# EAGLE design KranPowerV2_1 (EAGLE 6.1)
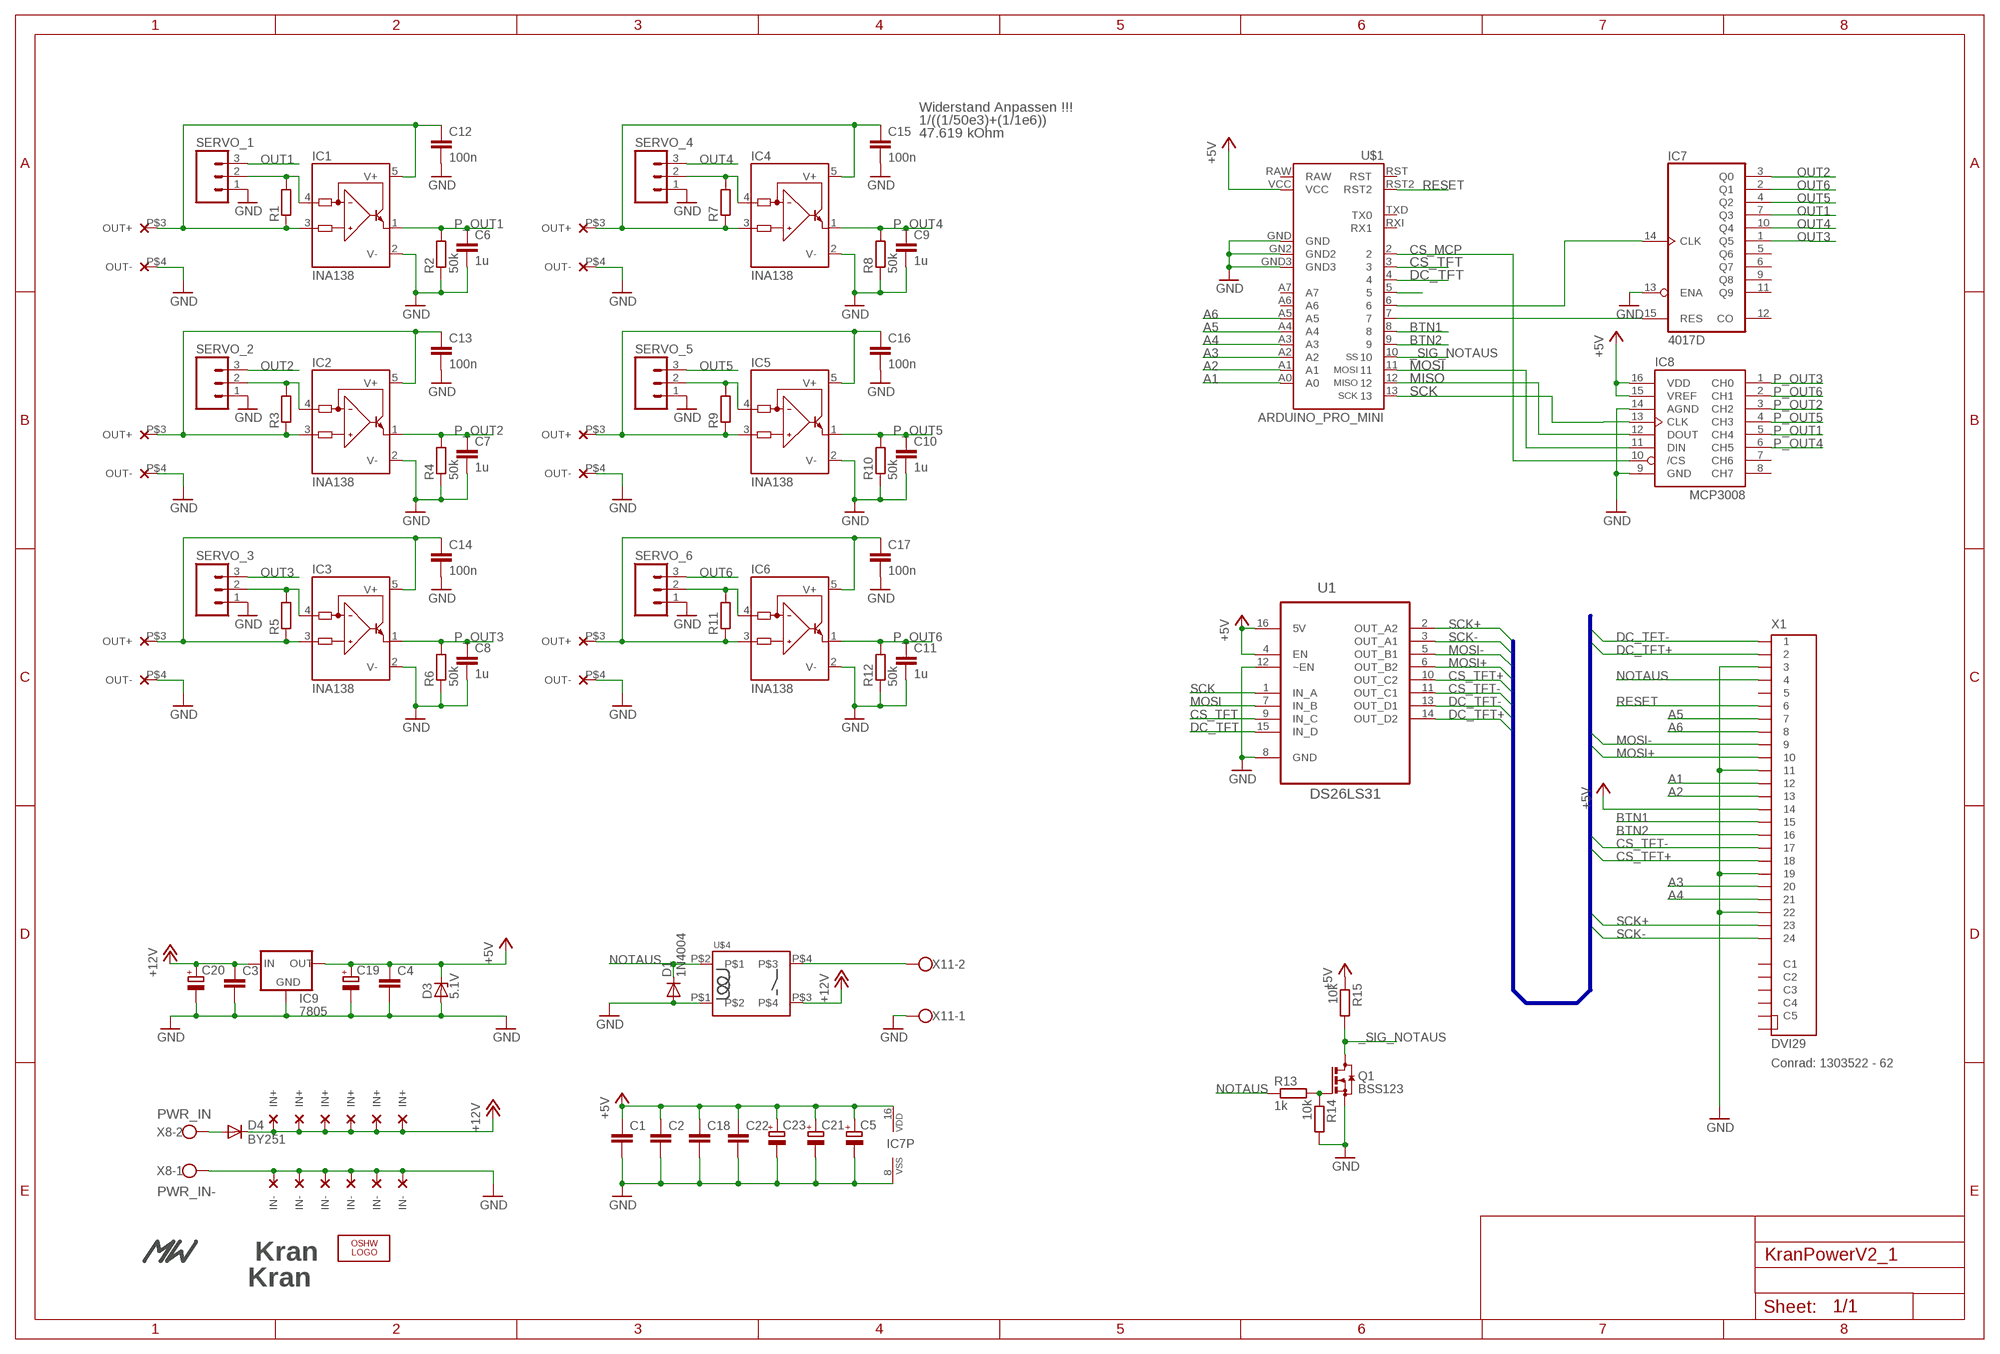
[diagram p0: schematic, sheet 1]

## Parts
C1  C-EUC0603  [C0603]
C2  C-EUC0603  [C0603]
C3  C-EUC0603  [C0603]
C4  C-EUC0603  [C0603]
C5  CPOL-EUSMCB  [SMC_B]
C6  1u  C-EUC0603  [C0603]
C7  1u  C-EUC0603  [C0603]
C8  1u  C-EUC0603  [C0603]
C9  1u  C-EUC0603  [C0603]
C10  1u  C-EUC0603  [C0603]
C11  1u  C-EUC0603  [C0603]
C12  100n  C-EUC0603  [C0603]
C13  100n  C-EUC0603  [C0603]
C14  100n  C-EUC0603  [C0603]
C15  100n  C-EUC0603  [C0603]
C16  100n  C-EUC0603  [C0603]
C17  100n  C-EUC0603  [C0603]
C18  C-EUC0603  [C0603]
C19  CPOL-EUSMCB  [SMC_B]
C20  CPOL-EUSMCB  [SMC_B]
C21  CPOL-EUSMCB  [SMC_B]
C22  C-EUC0603  [C0603]
C23  CPOL-EUSMCB  [SMC_B]
D1  1N4004  [DO41-10]
D3  5.1V  ZENER-DIODEDO34-7  [DO34Z7]
D4  BY251  [DO201-15]
IC1  INA138  [SOT23-5]
IC2  INA138  [SOT23-5]
IC3  INA138  [SOT23-5]
IC4  INA138  [SOT23-5]
IC5  INA138  [SOT23-5]
IC6  INA138  [SOT23-5]
IC7  4017D  [SO16]
IC8  MCP3008  [SO16]
IC9  7805  V_REG_78XXSIDE  [78XXL]
LOGO1  OSHW_LOGO_FILLX0350-NT  [OSHW_FILLX350_NOTEXT]
Q1  BSS123  [SOT23]
R1  R-EU_R2512  [R2512]
R2  50k  R-EU_R0603  [R0603]
R3  R-EU_R2512  [R2512]
R4  50k  R-EU_R0603  [R0603]
R5  R-EU_R2512  [R2512]
R6  50k  R-EU_R0603  [R0603]
R7  R-EU_R2512  [R2512]
R8  50k  R-EU_R0603  [R0603]
R9  R-EU_R2512  [R2512]
R10  50k  R-EU_R0603  [R0603]
R11  R-EU_R2512  [R2512]
R12  50k  R-EU_R0603  [R0603]
R13  1k  R-EU_R0603  [R0603]
R14  10k  R-EU_R0603  [R0603]
R15  10k  R-EU_R0603  [R0603]
SERVO_1  M03LOCK  [1X03_LOCK]
SERVO_2  M03LOCK  [1X03_LOCK]
SERVO_3  M03LOCK  [1X03_LOCK]
SERVO_4  M03LOCK  [1X03_LOCK]
SERVO_5  M03LOCK  [1X03_LOCK]
SERVO_6  M03LOCK  [1X03_LOCK]
U1  DS26LS31  DS26LS31CM  [SOIC127P600X175-16N]
U$1  ARDUINO_PRO_MINI  [ARDUINO_PRO_MINI]
U$2  MW_LOGO  [MW_11X5MM]
U$3  KRAN_LOGO  [KRAN_LOGO]
U$4  RELAY_ZETTLER_AZ767  [RELAY_ZETTLER_AZ767]
U$5  LM2596_STEPDOWN  [LM2596_STEPDOWN]
U$6  LM2596_STEPDOWN  [LM2596_STEPDOWN]
U$7  LM2596_STEPDOWN  [LM2596_STEPDOWN]
U$8  LM2596_STEPDOWN  [LM2596_STEPDOWN]
U$9  LM2596_STEPDOWN  [LM2596_STEPDOWN]
U$10  LM2596_STEPDOWN  [LM2596_STEPDOWN]
U$13  KRAN_LOGO  [KRAN_LOGO]
X1  DVI29  [CCDVI-29DVISIR-A-2]
X8  W237-102  [W237-102]
X11  W237-102  [W237-102]

## Nets
+5V: C1.1 C2.1 C4.1 C5.+ C18.1 C19.+ C21.+ C22.1 C23.+ D3.C IC7.16(VDD) IC8.15(VREF) IC8.16(VDD) IC9.OUT R15.1 U1.4(EN) U1.16(5V) U$1.VCC X1.14
+12V: C3.1 C20.+ D4.C IC9.IN U$4.P$3 U$5.P$1(IN+) U$6.P$1(IN+) U$7.P$1(IN+) U$8.P$1(IN+) U$9.P$1(IN+) U$10.P$1(IN+)
_SIG_NOTAUS: Q1.3(D) R15.2 U$1.10
A1: U$1.A0 X1.12
A2: U$1.A1 X1.13
A3: U$1.A2 X1.20
A4: U$1.A3 X1.21
A5: U$1.A4 X1.7
A6: U$1.A5 X1.8
BTN1: U$1.8 X1.15
BTN2: U$1.9 X1.16
CS_MCP: IC8.10(/CS) U$1.2
CS_TFT: U1.9(IN_C) U$1.3
CS_TFT+: U1.10(OUT_C2) X1.18
CS_TFT-: U1.11(OUT_C1) X1.17
DC_TFT: U1.15(IN_D) U$1.4
DC_TFT+: U1.14(OUT_D2) X1.2
DC_TFT-: U1.13(OUT_D1) X1.1
GND: C1.2 C2.2 C3.2 C4.2 C5.- C6.2 C7.2 C8.2 C9.2 C10.2 C11.2 C12.2 C13.2 C14.2 C15.2 C16.2 C17.2 C18.2 C19.- C20.- C21.- C22.2 C23.- D1.A D3.A IC1.2(V-) IC2.2(V-) IC3.2(V-) IC4.2(V-) IC5.2(V-) IC6.2(V-) IC7.8(VSS) IC7.13(ENA) IC8.9(GND) IC8.14(AGND) IC9.GND Q1.2(S) R2.1 R4.1 R6.1 R8.1 R10.1 R12.1 R14.2 SERVO_1.1 SERVO_2.1 SERVO_3.1 SERVO_4.1 SERVO_5.1 SERVO_6.1 U1.8(GND) U1.12(~EN) U$1.GN2(GND2) U$1.GND U$1.GND3 U$4.P$1 U$5.P$2(IN-) U$5.P$4(OUT-) U$6.P$2(IN-) U$6.P$4(OUT-) U$7.P$2(IN-) U$7.P$4(OUT-) U$8.P$2(IN-) U$8.P$4(OUT-) U$9.P$2(IN-) U$9.P$4(OUT-) U$10.P$2(IN-) U$10.P$4(OUT-) X1.3 X1.11 X1.19 X1.22 X8.1 X11.1
MISO: IC8.12(DOUT) U$1.12
MOSI: IC8.11(DIN) U1.7(IN_B) U$1.11
MOSI+: U1.6(OUT_B2) X1.10
MOSI-: U1.5(OUT_B1) X1.9
N$1: C12.1 IC1.3(IN+) IC1.5(V+) R1.1 U$5.P$3(OUT+)
N$2: IC1.4(IN-) R1.2 SERVO_1.2
N$3: C13.1 IC2.3(IN+) IC2.5(V+) R3.1 U$6.P$3(OUT+)
N$4: IC2.4(IN-) R3.2 SERVO_2.2
N$5: C14.1 IC3.3(IN+) IC3.5(V+) R5.1 U$7.P$3(OUT+)
N$6: IC3.4(IN-) R5.2 SERVO_3.2
N$7: C15.1 IC4.3(IN+) IC4.5(V+) R7.1 U$8.P$3(OUT+)
N$8: IC4.4(IN-) R7.2 SERVO_4.2
N$9: C16.1 IC5.3(IN+) IC5.5(V+) R9.1 U$9.P$3(OUT+)
N$10: IC5.4(IN-) R9.2 SERVO_5.2
N$11: C17.1 IC6.3(IN+) IC6.5(V+) R11.1 U$10.P$3(OUT+)
N$12: IC6.4(IN-) R11.2 SERVO_6.2
N$13: D4.A X8.2
N$14: IC7.14(CLK) U$1.6
N$15: IC7.15(RES) U$1.7
N$16: Q1.1(G) R13.2 R14.1
N$17: U$4.P$4 X11.2
N$18: U$1.5
NOTAUS: D1.C R13.1 U$4.P$2 X1.4
OUT1: IC7.7(Q3) SERVO_1.3
OUT2: IC7.3(Q0) SERVO_2.3
OUT3: IC7.1(Q5) SERVO_3.3
OUT4: IC7.10(Q4) SERVO_4.3
OUT5: IC7.4(Q2) SERVO_5.3
OUT6: IC7.2(Q1) SERVO_6.3
P_OUT1: C6.1 IC1.1(OUT) IC8.5(CH4) R2.2
P_OUT2: C7.1 IC2.1(OUT) IC8.3(CH2) R4.2
P_OUT3: C8.1 IC3.1(OUT) IC8.1(CH0) R6.2
P_OUT4: C9.1 IC4.1(OUT) IC8.6(CH5) R8.2
P_OUT5: C10.1 IC5.1(OUT) IC8.4(CH3) R10.2
P_OUT6: C11.1 IC6.1(OUT) IC8.2(CH1) R12.2
RESET: U$1.RST2 X1.6
SCK: IC8.13(CLK) U1.1(IN_A) U$1.13
SCK+: U1.2(OUT_A2) X1.23
SCK-: U1.3(OUT_A1) X1.24
Unconnected: IC7.5(Q6) IC7.6(Q7) IC7.9(Q8) IC7.11(Q9) IC7.12(CO) IC8.7(CH6) IC8.8(CH7) U$1.A6 U$1.A7 U$1.RAW U$1.RST U$1.RXI(RX1) U$1.TXD(TX0) X1.5 X1.C1 X1.C2 X1.C3 X1.C4 X1.C5.1(C5) X1.C5.2

## Buses
MISO+,MISO-,DC_TFT+,DC_TFT-,MOSI+,MOSI-,CS_TFT+,CS_TFT-,SCK+,SCK-

## Notes on the sheet
- Widerstand Anpassen !!!
- 1/((1/50e3)+(1/1e6))
- 47.619 kOhm
- Conrad: 1303522 - 62
- PWR_IN
- PWR_IN-
- /Users/MatthiasMac/Downloads/kran.bmp

## Library data of the parts
C1-C4 C6-C18 C22 = rcl:C-EU: CAPACITOR, European symbol
C5 C19-C21 C23 = rcl:CPOL-EU: POLARIZED CAPACITOR, European symbol
D1 = diode:1N4004: DIODE general purpose rectifier, 1 A
D3 = diode:ZENER-DIODE: Z-Diode
D4 = diode:BY251: DIODE Si, 200 V, 3 A
IC1-IC6 = burr-brown:INA138: High-Side Measurement Current Shunt Monitor; MF: TEXAS INSTRUMENTS; MPN: INA138NA/250; OC_FARNELL: 1564888; OC_NEWARK: 80K5906
IC7 = 40xx:4017: COUNTER/DIVIDER
IC8 = adafruit:MCP3008
IC9 = SparkFun:V_REG_78XX: Voltage Regulator Standard 7805 5V regulator. IGO (Input Ground Output). Spark Fun Electronics SKU : COM-00107
LOGO1 = ohw-logo:OSHW_LOGO_FILL
Q1 = transistor-small-signal:BSS123: N-CHANNEL MOS FET
R1-R15 = rcl:R-EU_: RESISTOR, European symbol
SERVO_1-SERVO_6 = SparkFun:M03: Header 3 Standard 3-pin 0.1" header. Use with straight break away headers (SKU : PRT-00116), right angle break away headers (PRT-00553), swiss pins (PRT-00743), machine pins (PRT-00117), and female headers (PRT-00115). Molex polarized connector foot print use with SKU : PRT-08232 with associated crimp pins and housings.
U1 = Matthias:DS26LS31CM: Line Driver; MPN: DS26LS31CM; OC_FARNELL: 9487859; OC_NEWARK: 07B5236; PACKAGE: SOIC-16; SUPPLIER: NationalSemiconductor
U$1 = SparkFun:ARDUINO_PRO_MINI
U$2 = MWlogo:MW_LOGO
U$3 U$13 = MWlogo:KRAN_LOGO
U$4 = SparkFun:RELAY_ZETTLER_AZ767: http://www.conrad.de/ce/de/product/503633/Subminiatur-Leistungs-Relais-AZ767-10-A-Zettler-Electronics-AZ767-1A-6DE-6-VDC-1-Schliesser-Max-DC-5-AAC-10-A-Max?queryFromSuggest=true
U$5-U$10 = LM2596_stepdown:LM2596_STEPDOWN
X1 = con-cypressindustries:DVI29: DVI 29 Connctor Source: http://www.cypressindustries.com/pdf/CCDVI-29DVISIR-A-2.pdf; OC_FARNELL: unknown; OC_NEWARK: unknown
X8 X11 = con-wago-500:W237-102: WAGO SCREW CLAMP; MPN: 237-102; OC_FARNELL: unknown; OC_NEWARK: 70K9898

## Board
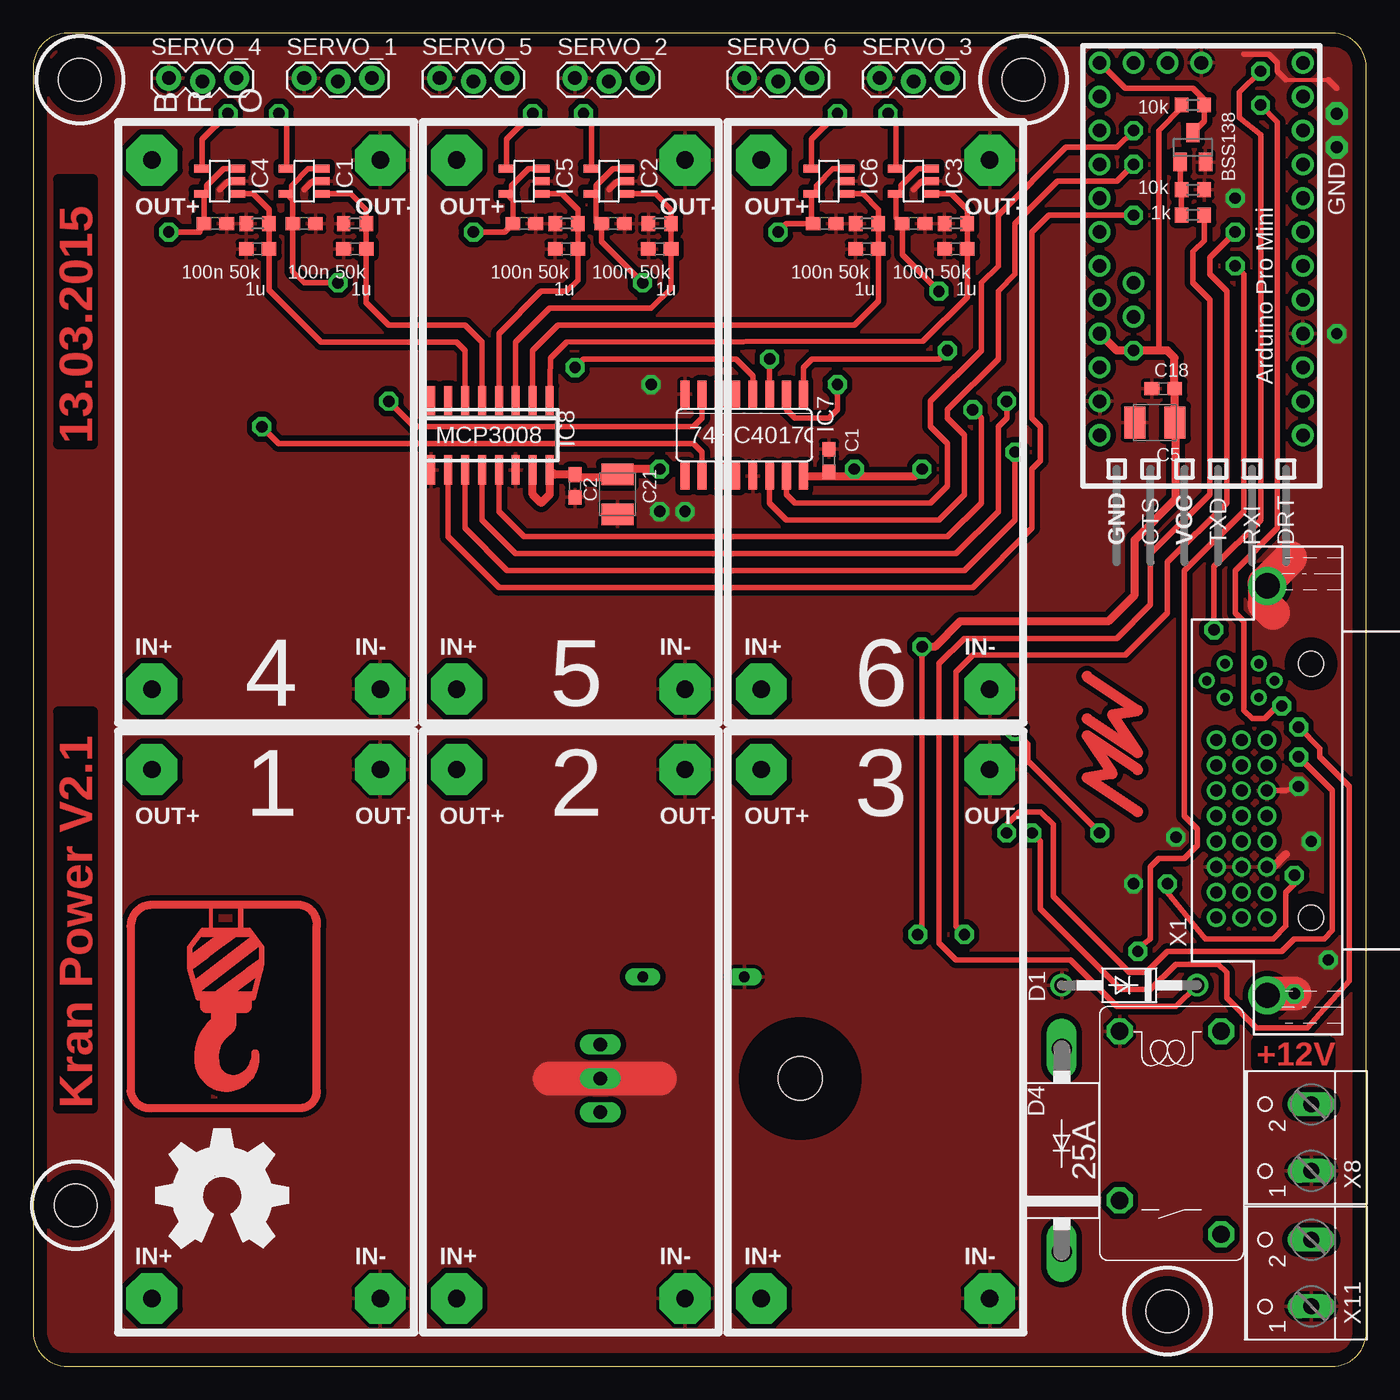
[diagram p1: board, top side]
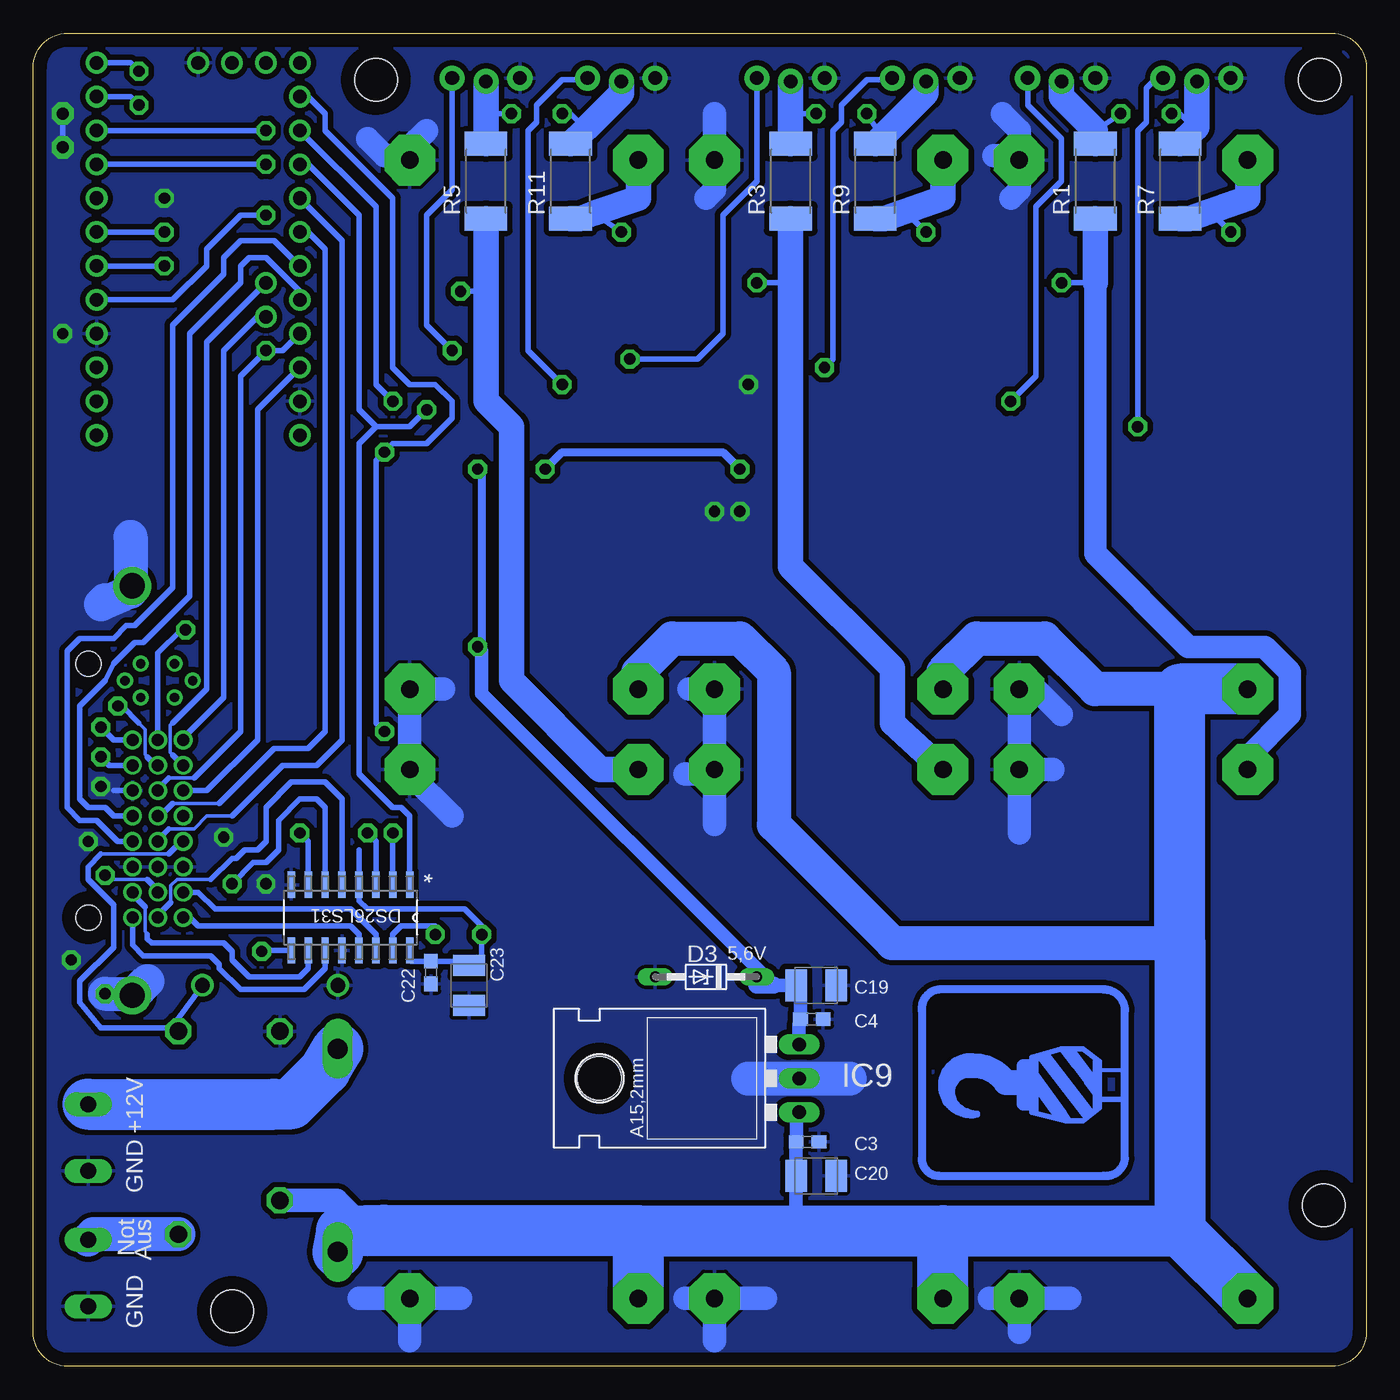
[diagram p2: board, bottom side, seen from below]

Size 100 x 100 mm. Coordinates in mm from the lower left corner, seen from the top.
Outline: 0,97.46 0,2.54 arc90 2.54,0 97.46,0 arc90 100,2.54 100,97.46 arc90 97.46,100 2.54,100 arc90 0,97.46
Copper layers (1*16): Top 0.035mm / dielectric 1.5mm / Bottom 0.035mm
Design rules: minimum track width 10mil, minimum drill 24mil, track to track 8mil, track to pad 8mil, pad to pad 8mil, via to via 8mil, smd to smd 8mil, copper to edge 40mil, drill to drill 8mil, minimum pad ring 10mil, minimum via ring 8mil, stop-mask expansion 4mil, vias tented up to drill 35mil, thermal gap 10mil
Holes 3.2 mm at 3.17,12.06 3.49,96.52 74.3,96.52 85.09,4.13

### Footprints (pad centres in the part's own frame; a part is rotated, then mirrored left to right if it is on the bottom)
C0603 = smd 1.1 x 1: 1 -0.85,0; 2 0.85,0
SMC_B = smd 1.6 x 2.4: + -1.5,0; - 1.5,0
DO41-10 = drill 1.118: A 5.08,0; C -5.08,0
DO34Z7 = drill 0.813 long: A 3.81,0; C -3.81,0
DO201-15 = drill 1.499 long: A 7.62,0; C -7.62,0
SOT23-5 = smd 0.6 x 1.2: 1 -0.95,-1.306; 2 0,-1.306; 3 0.95,-1.306; 4 0.95,1.306; 5 -0.95,1.306
SO16 = smd 0.66 x 2.032: 1 -4.445,-3.073; 2 -3.175,-3.073; 3 -1.905,-3.073; 4 -0.635,-3.073; 5 0.635,-3.073; 6 1.905,-3.073; 7 3.175,-3.073; 8 4.445,-3.073; 9 4.445,3.073; 10 3.175,3.073; 11 1.905,3.073; 12 0.635,3.073; 13 -0.635,3.073; 14 -1.905,3.073; 15 -3.175,3.073; 16 -4.445,3.073
SO16' = smd 0.6 x 2.2: 1 -4.445,-2.6; 2 -3.175,-2.6; 3 -1.905,-2.6; 4 -0.635,-2.6; 5 0.635,-2.6; 6 1.905,-2.6; 7 3.175,-2.6; 8 4.445,-2.6; 9 4.445,2.6; 10 3.175,2.6; 11 1.905,2.6; 12 0.635,2.6; 13 -0.635,2.6; 14 -1.905,2.6; 15 -3.175,2.6; 16 -4.445,2.6
78XXL = drill 1.016 long: GND 0,-3.81; IN -2.54,-3.81; OUT 2.54,-3.81 | hole 3.302: 0,11.176
SOT23 = smd 1 x 1.4: 1 -0.95,-1.1; 2 0.95,-1.1; 3 0,1.1
R2512 = smd 1.8 x 3.2: 1 -2.8,0; 2 2.8,0
R0603 = smd 1 x 1.1: 1 -0.85,0; 2 0.85,0
1X03_LOCK = drill 1.016 pad 1.88: 1 0,0.127; 2 2.54,-0.127; 3 5.08,0.127
SOIC127P600X175-16N = smd 1.981 x 0.559: 1 -2.464,4.445; 2 -2.464,3.175; 3 -2.464,1.905; 4 -2.464,0.635; 5 -2.464,-0.635; 6 -2.464,-1.905; 7 -2.464,-3.175; 8 -2.464,-4.445; 9 2.464,-4.445; 10 2.464,-3.175; 11 2.464,-1.905; 12 2.464,-0.635; 13 2.464,0.635; 14 2.464,1.905; 15 2.464,3.175; 16 2.464,4.445
ARDUINO_PRO_MINI = drill 1.016 pad 1.626: 2 1.27,19.05; 3 1.27,16.51; 4 1.27,13.97; 5 1.27,11.43; 6 1.27,8.89; 7 1.27,6.35; 8 1.27,3.81; 9 1.27,1.27; 10 16.51,1.27; 11 16.51,3.81; 12 16.51,6.35; 13 16.51,8.89; A0 16.51,11.43; A1 16.51,13.97; A2 16.51,16.51; A3 16.51,19.05; A4 13.97,17.78; A5 13.97,20.32; A6 11.43,1.27; A7 13.97,1.27; GN2 16.51,26.67; GND 1.27,21.59; GND3 8.89,1.27; RAW 16.51,29.21; RST 1.27,24.13; RST2 16.51,24.13; RXI 1.27,26.67; TXD 1.27,29.21; VCC 16.51,21.59
RELAY_ZETTLER_AZ767 = drill 1.3 octagon: P$1 1.85,1.49; P$2 1.85,9.11; P$3 14.55,1.49; P$4 17.09,9.11
LM2596_STEPDOWN = drill 1.3 pad 3.81 octagon: P$1 0,0; P$2 17.145,0; P$3 0,39.69; P$4 17.145,39.69
CCDVI-29DVISIR-A-2 = drill 0.9 pad 1.27: 1 -9.525,9.04; 2 -7.62,9.04; 3 -5.715,9.04; 4 -3.81,9.04; 5 -1.905,9.04; 6 0,9.04; 7 1.905,9.04; 8 3.81,9.04; 9 -9.525,7.135; 10 -7.62,7.135; 11 -5.715,7.135; 12 -3.81,7.135; 13 -1.905,7.135; 14 0,7.135; 15 1.905,7.135; 16 3.81,7.135; 17 -9.525,5.23; 18 -7.62,5.23; 19 -5.715,5.23; 20 -3.81,5.23; 21 -1.905,5.23; 22 0,5.23; 23 1.905,5.23; 24 3.81,5.23 | drill 0.7 pad 1.016: C1 6.985,8.382; C2 9.525,8.382; C3 6.985,5.842; C4 9.525,5.842; C5.1 8.255,9.745; C5.2 8.255,4.665 | drill 1.9 pad 2.54: M1 -15.365,5.205; M2 15.365,5.205 | hole 1.9: -9.525,1.93; 9.525,1.93
W237-102 = drill 1.194 long: 1 -2.5,-1.27; 2 2.5,-1.27

### Placement (x,y rotation side)
C1  59.69,67.94 90 top
C2  40.64,66.04 270 top
C3  41.91,16.83 0 bottom
C4  41.59,26.04 0 bottom
C5  84.14,70.8 180 top
C6  24.13,83.82 180 top
C7  46.99,83.82 180 top
C8  69.22,83.82 180 top
C9  16.83,83.82 180 top
C10  40.01,83.82 180 top
C11  62.55,83.82 180 top
C12  20.32,85.72 0 top
C13  43.5,85.72 0 top
C14  66.04,85.72 0 top
C15  13.65,85.72 0 top
C16  36.83,85.72 0 top
C17  59.37,85.72 0 top
C18  84.77,73.34 180 top
C19  41.27,28.57 0 bottom
C20  41.27,14.29 0 bottom
C21  43.81,65.41 270 top
C22  70.17,29.53 270 bottom
C23  67.31,28.57 270 bottom
D1  82.23,28.57 180 top
D3  49.53,29.21 180 bottom
D4  77.15,16.19 90 top
IC1  20.32,88.9 90 top
IC2  43.18,88.9 90 top
IC3  66.04,88.9 90 top
IC4  13.97,88.9 90 top
IC5  36.83,88.9 90 top
IC6  59.69,88.9 90 top
IC7  53.34,69.85 180 top
IC8  MCP3008  [SO16']  34.29,69.85 180 top
IC9  46.35,21.59 90 bottom
LOGO1  9.21,8.89 0 top
Q1  87,91.44 0 top
R1  20.32,88.9 90 bottom
R2  24.13,85.72 0 top
R3  43.18,88.9 90 bottom
R4  46.99,85.72 0 top
R5  66.04,88.9 90 bottom
R6  69.22,85.72 0 top
R7  13.97,88.9 90 bottom
R8  16.83,85.72 0 top
R9  36.83,88.9 90 bottom
R10  40.01,85.72 0 top
R11  59.69,88.9 90 bottom
R12  62.55,85.72 0 top
R13  87,86.36 180 top
R14  87,88.27 0 top
R15  87,94.61 0 top
SERVO_1  20.32,96.52 0 top
SERVO_2  40.64,96.52 0 top
SERVO_3  63.5,96.52 0 top
SERVO_4  10.16,96.52 0 top
SERVO_5  30.48,96.52 0 top
SERVO_6  53.34,96.52 0 top
U1  76.2,33.66 270 bottom
U$1  96.52,99.06 180 top
U$2  82.87,41.59 90 top
U$3  33.66,28.57 270 bottom
U$4  80.01,26.99 270 top
U$5  8.89,5.08 0 top
U$6  31.75,5.08 0 top
U$7  54.61,5.08 0 top
U$8  8.89,50.8 0 top
U$9  31.75,50.8 0 top
U$10  54.61,50.8 0 top
U$11  [MW_11X5MM_SOLDER]  82.87,41.59 90 top
U$12  [KRAN_LOGO_STOP]  33.66,28.57 270 bottom
U$13  6.99,19.05 0 top
U$14  [KRAN_LOGO_STOP]  6.99,19.05 0 top
X1  97.79,43.18 90 top
X8  94.61,17.14 90 top
X11  94.61,6.99 90 top

### Tracks (layer width: path | path; a pad name or v marks a point on that pad's centre or on a via)
+5V  (via drill 0.85 pad 1.42)
  Top 0.406: C1.1 59.69,66.78 | R15.1 86.14,94.4 84.45,92.71 84.45,76.2 | v66.36,32.38 66.36,32.7 66.67,33.02 v66.67,53.98
  Top 0.61: 61.59,66.78 59.69,66.78 IC7.16 58.52,66.78 | 61.59,66.78 66.14,66.78 v66.67,67.31 | v46.99,67.31 44.45,67.31 43.81,66.67 | v61.59,67.31 61.59,66.78 | 43.81,66.67 C21.+ | 43.81,66.67 40.85,66.67 C2.1 39.09,66.89 IC8.16 38.73,65.41 38.1,64.77 37.47,65.41 IC8.15 | U$1.VCC 81.28,76.2 v82.55,76.2 84.45,76.2 85.09,76.2 85.62,75.67 C18.1 85.64,73.33 C5.+ 85.72,70.72 85.72,65.09 82.64,62 82.64,57.87 80.64,55.88 69.53,55.88 67.63,53.98 v66.67,53.98
  Bottom 0.254: 89.85,44.13 87.95,44.13
  Bottom 0.406: X1.14 90.66,43.33 89.85,44.13 | 87.95,44.13 84.45,47.62 84.45,74.3 v82.55,76.2 81.28,76.2 U$1.VCC | 75.56,38.73 U1.4 75.56,34.92 74.93,34.29 67.63,34.29 66.36,33.02 v66.36,32.38 66.36,30.8 67.08,30.07 C23.+ 67.61,30.38 C22.1 71.65,30.38 71.75,30.48 U1.16 | 45.72,28.57 D3.C
  Bottom 0.61: v66.67,67.31 66.36,66.99 66.36,54.29 v66.67,53.98 | v61.59,67.31 60.33,68.58 48.26,68.58 v46.99,67.31
  Bottom 1.016: v66.67,53.98 66.36,53.66 66.36,50.48 44.45,28.57 C19.+ 42.46,28.27 C4.1 42.55,25.61 IC9.OUT
  Bottom 1.27: 44.45,28.57 45.72,28.57
+12V
  Bottom 1.016: 67.31,11.43 67.31,10.16 | 42.86,10.16 42.77,10.25 C20.+ 42.77,16.5 C3.1 42.76,18.84 IC9.IN
  Bottom 1.778: U$4.P$3 77.25,12.44 74.97,10.16
  Bottom 2.54: U$9.P$1 31.75,52.07 29.21,54.61 24.13,54.61 20.32,50.8 13.97,50.8 | U$10.P$1 54.61,52.07 52.07,54.61 46.99,54.61 44.45,52.07 44.45,40.64 35.56,31.75 13.97,31.75
  Bottom 3.81: U$6.P$1 31.75,10.16 | 31.75,10.16 13.97,10.16 | 13.97,10.16 U$5.P$1 | U$7.P$1 54.61,10.16 | 54.61,10.16 42.86,10.16 31.75,10.16 | 54.61,10.16 67.31,10.16 74.97,10.16 | 13.97,10.16 13.97,31.75 13.97,50.8 U$8.P$1 | 74.97,10.16 73.7,10.2 | 74.97,10.16 76.88,10.12 D4.C
_SIG_NOTAUS
  Top 0.406: U$1.10 81.92,95.89 87,95.89 87.84,95.03 R15.2 87.84,93.39 Q1.3
A1
  Bottom 0.254: 89.85,40.32 87.95,40.32 87,41.27 85.09,41.27
  Bottom 0.406: X1.12 90.66,39.52 89.85,40.32 | 85.09,41.27 81.28,45.09 78.74,45.09 76.83,46.99 76.83,84.45 U$1.A0
A2
  Bottom 0.254: 89.53,42.23 86.04,42.23
  Bottom 0.406: X1.13 90.49,41.27 89.53,42.23 | 86.04,42.23 81.92,46.35 79.38,46.35 78.11,47.62 78.11,83.82 79.38,85.09 U$1.A1
A3
  Bottom 0.406: X1.20 93.66,39.37 95.25,40.96 96.52,40.96 97.47,41.91 97.47,53.66 96.52,54.61 93.98,54.61 93.03,55.56 92.39,55.56 89.53,58.42 89.53,78.11 85.72,81.92 85.72,83.19 84.45,84.45 81.92,84.45 U$1.A2
A4
  Bottom 0.406: X1.21 93.98,41.27 94.61,41.91 95.89,41.91 96.52,42.55 96.52,49.53 94.61,51.44 93.98,52.7 92.39,54.29 91.76,54.29 88.27,57.78 88.27,77.47 84.45,81.28 84.45,82.55 83.82,83.19 82.55,83.19 80.01,80.64 U$1.A3
A5
  Bottom 0.254: 89.53,45.87 89.53,45.89 89.71,46.05 89.71,48.1 89.53,48.26
  Bottom 0.406: U$1.A4 87,76.83 87,50.8 89.53,48.26 | 89.53,45.87 X1.7
A6
  Bottom 0.406: X1.8 88.75,47.14 85.72,50.16 85.72,76.2 83.19,78.74 U$1.A5
BTN1  (via drill 0.85 pad 1.42)
  Top 0.406: v93.66,49.53 93.34,49.53 92.39,48.58 91.44,48.58 90.81,49.21 90.81,55.88 90.17,56.52 90.17,59.69 93.34,62.87 93.34,93.34 v92.08,94.61
  Bottom 0.254: 91.44,45.72 91.44,45.73 91.61,45.88 91.61,47.78 92.08,48.26
  Bottom 0.406: X1.15 90.81,45.09 91.44,45.72 | 92.08,48.26 93.34,49.53 v93.66,49.53 | v92.08,94.61 92.71,95.25 U$1.8
BTN2  (via drill 0.85 pad 1.42)
  Top 0.406: v88.58,55.24 88.58,60.01 92.08,63.5 92.08,92.39 90.49,93.66 90.49,95.57 v92.08,97.16
  Bottom 0.406: X1.16 90.66,53.49 88.9,55.24 v88.58,55.24 | v92.08,97.16 92.71,97.79 U$1.9
CS_MCP  (via drill 0.85 pad 1.42)
  Top 0.406: IC8.10 31.11,62.23 34.92,58.42 70.48,58.42 74.93,62.87 74.93,67.31 75.56,67.94 75.56,70.48 74.93,71.12 74.93,85.09 76.2,86.36 v82.55,86.36
  Bottom 0.406: v82.55,86.36 84.45,86.36 87,83.82 87,82.55 89.53,80.01 U$1.2
CS_TFT  (via drill 0.85 pad 1.42)
  Top 0.406: v82.87,31.11 82.55,31.11 83.82,32.07 83.82,37.47 84.45,38.1 86.36,38.1 87.31,39.05 87.31,40.32 86.36,41.27 86.36,59.69 90.81,64.14 90.81,81.92 v90.17,82.55
  Bottom 0.406: U1.9 82.47,31.19 v82.87,31.11 | v90.17,82.55 U$1.3
CS_TFT+
  Bottom 0.254: 91.44,32.38 91.44,32.42 91.61,32.6 91.61,34.47
  Bottom 0.406: X1.18 92.56,35.41 91.61,34.47 | 91.44,32.38 91.44,32.07 91.12,31.75 85.72,31.75 85.09,31.11 85.09,30.48 83.82,29.21 80.01,29.21 79.38,29.84 U1.10
CS_TFT-
  Bottom 0.406: X1.17 92.56,31.6 91.76,30.8 86.68,30.8 86.04,30.16 86.04,29.84 84.45,28.26 79.69,28.26 78.11,29.84 U1.11
DC_TFT  (via drill 0.85 pad 1.42)
  Top 0.406: v69.85,32.38 69.22,33.02 69.22,52.07 70.48,53.34 81.92,53.34 85.09,56.52 85.09,60.33 89.53,64.77 89.53,80.64 88.27,81.92 88.27,83.19 v90.17,85.09
  Bottom 0.406: U1.15 73.03,32.38 72.39,33.02 69.85,33.02 v69.85,32.38 | v90.17,85.09 U$1.4
DC_TFT+
  Bottom 0.406: X1.2 87.63,35.56 86.36,34.29 76.2,34.29 74.3,32.38 U1.14
DC_TFT-
  Bottom 0.406: X1.1 88.27,33.66 87.63,33.02 76.2,33.02 75.56,32.38 U1.13
GND  (via drill 0.85 pad 1.42, 0.9 pad 1.68)
  Top 0.305: 93.98,96.52 97.16,96.52
  Top 0.406: C12.2 20.95,85.72 | IC4.2 14.61,88.9 13.97,88.27 | IC1.2 20.95,88.9 20.32,88.27 | IC2.2 43.81,88.9 43.18,88.27 | IC3.2 66.67,88.9 66.04,88.27 | 90.81,98.42 92.71,98.42 93.34,97.79 93.34,97.16 93.98,96.52 | 97.16,96.52 97.79,95.89 | v94.93,43.5 93.98,43.18 X1.22
  Top 0.61: X1.19 93.03,37.47 93.98,38.42
  Top 2.54: 38.73,21.59 46.99,21.59 | 94.3,60.64 92.39,58.74 92.39,57.15 93.03,56.52 | v94.61,27.94 92.71,27.94
  Bottom 0.406: X1.22 93.98,43.18 | v97.79,93.98 v97.79,91.44
  Bottom 1.778: 26.04,40.01 U$5.P$4 | U$5.P$4 U$8.P$2 24.77,50.8 22.86,48.9 | 48.9,44.45 U$9.P$2 50.8,50.8 | 48.9,44.45 48.9,40.64 | 67.94,5.08 U$7.P$2 | U$7.P$2 71.75,1.91 | 45.09,5.08 U$6.P$2 | U$6.P$2 48.9,1.91 | 22.23,5.08 U$5.P$2 | U$5.P$2 26.04,2.54 | U$10.P$2 71.75,44.45 68.58,41.27 | 71.12,50.8 69.22,50.8 | U$7.P$2 75.56,5.08 | 72.39,90.81 73.66,90.81 74.93,92.08 | 71.75,90.81 71.75,91.44 70.48,92.71 | 48.9,89.53 48.9,88.27 49.53,87.63 | 48.9,90.81 48.9,93.98 | 26.04,90.81 26.04,92.71 27.3,93.98 | 26.04,90.81 27.94,90.81 | 26.04,90.81 26.04,88.27 26.67,87.63 | 48.9,44.45 51.12,44.45 | U$5.P$4 23.5,44.77 | U$6.P$2 51.12,5.08 | U$5.P$2 28.26,5.08
  Bottom 2.54: 46.35,21.59 38.73,21.59 | 92.71,62.23 92.71,58.1 94.93,57.15 94.61,57.47 | 91.44,28.89 92.39,27.94 v94.61,27.94
  other vias: 82.55,36.2 95.89,39.37 46.99,64.14 48.9,64.14 46.35,73.66 90.17,87.63 97.79,77.47 85.72,39.69 97.16,30.48
  pour Top (isolate 0.406): 0,0 97.83,0 arc90 100.33,2.5 100.33,97.83 arc90 97.83,100.33 2.5,100.33 arc90 0,97.83
  pour Bottom (isolate 0.406): 0,0 97.83,0 arc90 100.33,2.5 100.33,97.83 arc90 97.83,100.33 2.5,100.33 arc90 0,97.83
MISO  (via drill 0.85 pad 1.42)
  Top 0.406: IC8.12 33.66,63.5 36.2,60.96 69.22,60.96 72.39,64.14 72.39,70.48 73.03,71.12 v73.03,72.39
  Bottom 0.406: U$1.12 74.3,87 74.3,73.66 v73.03,72.39
MOSI  (via drill 0.85 pad 1.42)
  Top 0.406: IC8.11 32.38,62.87 35.56,59.69 69.85,59.69 73.66,63.5 v73.66,68.58 | v73.66,47.62 74.61,46.67 74.61,45.4 v80.01,40.01
  Bottom 0.406: U$1.11 79.38,95.25 78.11,93.98 78.11,92.71 73.03,87.63 73.03,74.93 71.75,73.66 69.85,73.66 68.58,72.39 68.58,71.12 70.48,69.22 73.03,69.22 v73.66,68.58 74.3,67.94 74.3,48.26 v73.66,47.62 | U1.7 79.38,39.37 v80.01,40.01
MOSI+  (via drill 0.85 pad 1.42)
  Top 0.406: v94.61,36.83 94.61,36.2 93.98,35.56 93.98,33.02 93.03,32.07 87.95,32.07 85.09,35.56 v85.09,36.2
  Bottom 0.254: 91.44,36.51 94.3,36.51
  Bottom 0.406: X1.10 90.66,35.73 91.44,36.51 | 94.3,36.51 v94.61,36.83 | U1.6 78.11,41.91 78.74,42.55 80.01,42.55 81.6,40.96 81.6,38.73 82.55,37.78 83.5,37.78 v85.09,36.2
MOSI-
  Bottom 0.254: 89.69,34.81 89.69,36.08 89.22,36.51 86.68,36.51
  Bottom 0.406: X1.9 90.66,33.8 89.69,34.81 | U1.5 76.83,42.55 78.11,43.81 80.64,43.81 82.55,41.91 82.55,39.37 83.19,38.73 84.14,38.73 84.77,38.1 85.09,38.1 86.68,36.51
N$1  (via drill 0.85 pad 1.42)
  Top 0.406: IC1.3 20.64,89.85 19.37,88.58 19.37,87.95 IC1.5 19.47,87.49 C12.1 19.47,82.13 20.32,81.28 v22.86,81.28
  Bottom 0.406: R1.1 20.32,86.36 | v22.86,81.28 20.32,81.28
  Bottom 1.676: U$5.P$3 8.89,45.72 5.71,48.9 5.71,52.07 7.62,53.98 13.34,53.98 20.32,60.96 20.32,81.28
  Bottom 1.93: 20.32,81.28 R1.1
N$2  (via drill 0.85 pad 1.42)
  Top 0.406: IC1.4 19.01,93.38 v18.41,93.98
  Bottom 0.406: v18.41,93.98 20.32,92.71
  Bottom 1.93: R1.2 20.32,92.71 22.86,95.25 SERVO_1.2
N$3  (via drill 0.85 pad 1.42)
  Top 0.406: IC2.5 42.23,87.95 | IC2.3 43.49,89.85 42.23,88.58 42.23,87.95 | 42.23,87.95 42.23,85.83 C13.1 42.65,84.35 v45.72,81.28
  Bottom 0.406: v45.72,81.28 43.18,81.28
  Bottom 1.93: R3.1 43.18,81.28 43.18,60.01 35.56,52.39 35.56,48.26 U$6.P$3
N$4  (via drill 0.85 pad 1.42)
  Top 0.406: IC2.4 41.87,93.38 v41.27,93.98
  Bottom 0.406: v41.27,93.98 42.8,93.98 R3.2
  Bottom 1.93: SERVO_2.2 R3.2
N$5  (via drill 0.85 pad 1.42)
  Top 0.406: IC3.3 66.36,89.85 65.09,88.58 65.09,87.95 IC3.5 64.73,86.18 C14.1 65.19,83.4 v67.94,80.64
  Bottom 0.406: v67.94,80.64 66.04,80.64
  Bottom 1.93: U$7.P$3 57.47,44.77 64.14,51.44 64.14,70.48 66.04,72.39 66.04,80.64 R5.1
N$6  (via drill 0.85 pad 1.42)
  Top 0.406: IC3.4 64.73,93.38 v64.14,93.98
  Bottom 0.406: v64.14,93.98 66.04,93.98
  Bottom 1.93: SERVO_3.2 66.04,93.98 R5.2
N$7  (via drill 0.85 pad 1.42)
  Top 0.406: IC4.3 14.29,89.85 13.02,88.58 13.02,87.95 IC4.5 12.8,87.81 C15.1 12.48,85.09 v10.16,85.09
  Bottom 0.406: 13.28,86.1 11.17,86.1 v10.16,85.09
  Bottom 1.93: R7.1 13.28,86.1 8.89,87.63 U$8.P$3
N$8  (via drill 0.85 pad 1.42)
  Top 0.406: IC4.4 12.66,92.04 v14.61,93.98
  Bottom 0.406: v14.61,93.98 13.97,93.98 12.83,92.84
  Bottom 1.93: SERVO_4.2 12.7,92.97 12.83,92.84 R7.2
N$9  (via drill 0.85 pad 1.42)
  Top 0.406: IC5.3 37.15,89.85 35.88,88.58 35.88,87.95 IC5.5 35.98,87.49 C16.1 35.34,85.09 v33.02,85.09
  Bottom 0.406: 36.14,86.1 34.03,86.1 v33.02,85.09
  Bottom 1.93: R9.1 36.14,86.1 31.75,87.63 U$9.P$3
N$10  (via drill 0.85 pad 1.42)
  Top 0.406: IC5.4 35.52,92.04 v37.47,93.98
  Bottom 0.406: v37.47,93.98 36.33,92.2
  Bottom 1.93: SERVO_5.2 33.02,95.51 36.33,92.2 R9.2
N$11  (via drill 0.85 pad 1.42)
  Top 0.406: IC6.3 60.01,89.85 58.74,88.58 58.74,87.95 IC6.5 58.38,86.18 C17.1 56.52,85.72 v55.88,85.09
  Bottom 0.406: v55.88,85.09 57.95,86.52
  Bottom 1.93: R11.1 59,86.1 57.95,86.52 54.61,87.63 U$10.P$3
N$12  (via drill 0.85 pad 1.42)
  Top 0.406: IC6.4 58.38,92.04 v60.33,93.98
  Bottom 0.406: v60.33,93.98 59.69,93.98 58.55,92.84
  Bottom 1.93: SERVO_6.2 55.88,95.51 58.55,92.84 R11.2
N$13
  Bottom 3.81: D4.A 78.11,22.23 80.64,19.68 81.95,19.64 X8.2
N$14  (via drill 0.85 pad 1.42)
  Top 0.406: IC7.14 55.24,64.77 56.52,63.5 67.94,63.5 69.85,65.41 69.85,69.85 68.58,71.12 68.58,71.75 72.39,75.56 72.39,80.64 73.66,81.92 73.66,85.72 76.83,88.9 81.28,88.9 v82.55,90.17
  Bottom 0.406: v82.55,90.17 U$1.6
N$15  (via drill 0.85 pad 1.42)
  Top 0.406: IC7.15 56.52,65.41 57.15,64.77 67.31,64.77 68.58,66.04 68.58,69.22 67.31,70.48 67.31,72.39 71.12,76.2 71.12,81.28 72.39,82.55 72.39,86.36 77.47,91.44 81.28,91.44 v82.55,92.71
  Bottom 0.406: v82.55,92.71 U$1.7
N$16
  Top 0.406: Q1.1 86.05,88.36 R14.1 R13.2
N$17
  Bottom 2.54: U$4.P$4 95.47,9.9 X11.2
NOTAUS
  Top 0.406: R13.1 87.84,84.45 87,83.61 87,81.28 88.27,80.01 88.27,65.41 83.82,60.96 83.82,57.15 81.28,54.61 69.85,54.61 67.94,52.7 67.94,31.75 69.22,30.48 77.79,30.48 81.28,26.99 85.72,26.99 D1.C
  Bottom 0.254: 89.85,38.42 94.93,38.42
  Bottom 0.406: X1.4 88.9,39.37 89.85,38.42 | 94.93,38.42 95.89,37.47 95.89,36.51 93.98,34.61 93.98,31.43 96.52,28.89 96.52,27.3 94.93,25.4 89.53,25.4 89.22,25.23 U$4.P$2 89.22,25.99 D1.C
OUT1  (via drill 0.85 pad 1.42)
  Top 0.406: IC7.7 50.16,71.12 49.53,70.48 28.57,70.48 v26.67,72.39
  Bottom 0.406: SERVO_1.3 25.4,94.61 22.86,92.08 22.86,88.9 24.77,87 24.77,74.3 v26.67,72.39
OUT2  (via drill 0.85 pad 1.42)
  Top 0.406: IC7.3 v55.24,75.56
  Bottom 0.406: v55.24,75.56 50.16,75.56 48.26,77.47 48.26,86.36 45.72,88.9 SERVO_2.3
OUT3  (via drill 0.85 pad 1.42)
  Top 0.406: IC7.1 57.78,74.93 58.42,75.56 67.94,75.56 v68.58,76.2
  Bottom 0.406: v68.58,76.2 70.48,78.11 70.48,86.36 68.58,88.27 SERVO_3.3
OUT4  (via drill 0.85 pad 1.42)
  Top 0.406: IC7.10 50.16,68.58 49.53,69.22 18.41,69.22 v17.14,70.48
  Bottom 0.406: v17.14,70.48 17.14,92.71 16.51,93.34 16.51,95.89 15.88,96.52 15.37,96.52 SERVO_4.3
OUT5  (via drill 0.85 pad 1.42)
  Top 0.406: IC7.4 53.98,74.3 52.7,75.56 41.27,75.56 v40.64,74.93
  Bottom 0.406: v40.64,74.93 40.01,75.56 40.01,92.71 39.37,93.34 39.37,94.61 37.47,96.52 35.69,96.52 SERVO_5.3
OUT6  (via drill 0.85 pad 1.42)
  Top 0.406: IC7.2 56.52,71.75 57.15,71.12 59.69,71.12 60.33,71.75 v60.33,73.66
  Bottom 0.406: v60.33,73.66 62.87,76.2 62.87,92.71 62.23,93.34 62.23,94.61 60.33,96.52 58.55,96.52 SERVO_6.3
P_OUT1
  Top 0.406: IC1.1 23.81,87.95 24.98,86.78 R2.2 C6.1 24.98,79.8 26.67,78.11 32.38,78.11 33.66,76.83 IC8.5
P_OUT2
  Top 0.406: IC2.1 46.67,87.95 47.84,86.78 R4.2 C7.1 47.84,80.86 46.35,79.38 38.73,79.38 36.2,76.83 IC8.3
P_OUT3
  Top 0.406: IC3.1 68.89,87.95 70.06,86.78 R6.2 C8.1 70.06,80.22 66.73,76.89 40.01,76.83 38.8,75.62 IC8.1
P_OUT4
  Top 0.406: IC4.1 16.51,87.95 17.68,86.78 R8.2 C9.1 17.68,80.75 21.59,76.83 31.75,76.83 32.38,76.2 IC8.6
P_OUT5
  Top 0.406: IC5.1 39.69,87.95 40.85,86.78 R10.2 C10.1 40.85,81.5 40.01,80.64 38.1,80.64 34.92,77.47 IC8.4
P_OUT6
  Top 0.406: IC6.1 62.23,87.95 63.4,86.78 R12.2 C11.1 63.4,79.91 61.59,78.11 39.37,78.11 37.47,76.2 IC8.2
RESET
  Bottom 0.406: X1.6 87,43.18 83.19,46.99 83.19,71.75 U$1.RST2
SCK  (via drill 0.85 pad 1.42)
  Top 0.406: IC8.13 34.92,64.14 36.83,62.23 68.58,62.23 71.12,64.77 71.12,71.12 v70.48,71.75
  Bottom 0.406: U$1.13 79.38,90.17 75.56,86.36 75.56,71.75 74.3,70.48 | 74.3,70.48 71.75,70.48 v70.48,71.75 | U1.1 71.75,41.27 72.39,41.91 73.03,41.91 75.56,44.45 75.56,69.22 74.3,70.48
SCK+  (via drill 0.85 pad 1.42)
  Top 0.406: v73.03,40.01 73.03,40.64 73.98,41.59 75.56,41.59 76.52,40.64 76.52,35.24 82.23,29.53 83.5,29.53 85.09,31.11 93.66,31.11 94.61,32.07 96.84,32.07 97.47,32.7 97.47,43.18 v94.93,45.72
  Bottom 0.406: X1.23 94.3,45.09 v94.93,45.72 | U1.2 v73.03,40.01
SCK-  (via drill 0.85 pad 1.42)
  Top 0.406: v74.93,40.01 75.56,39.37 75.56,34.29 81.6,28.26 83.82,28.26 85.72,30.16 88.9,30.16 89.53,29.53 89.53,27.62 91.76,25.4 95.57,25.4 98.74,28.89 98.74,43.5 96.52,45.72 96.52,46.35 v94.93,47.94
  Bottom 0.406: X1.24 93.98,46.99 v94.93,47.94 | v74.93,40.01 74.3,39.37 U1.3

### Text on the board
Top: 13.03.2015 | +12V | Kran Power V2.1
tPlace: B | R | O
tNames: 10k | BSS138 | 10k | 1k | GND | 100n 50k | 100n 50k | 100n 50k | 100n 50k | 100n 50k | 100n 50k | 1u | 1u | 1u | 1u | 1u | 1u | Arduino Pro Mini | MCP3008 | 74HC4017 | GND | CTS | VCC | TXD | RXI | DRT | 4 | 5 | 6 | 1 | 2 | 3 | 25A
bNames: DS26LS31 | 5,6V | +12V | GND | Aus | Not | GND
tStop: 13.03.2015 | +12V | Kran Power V2.1